# Altium schematic sheet 12_PLCLK_100M.SchDoc
size A4
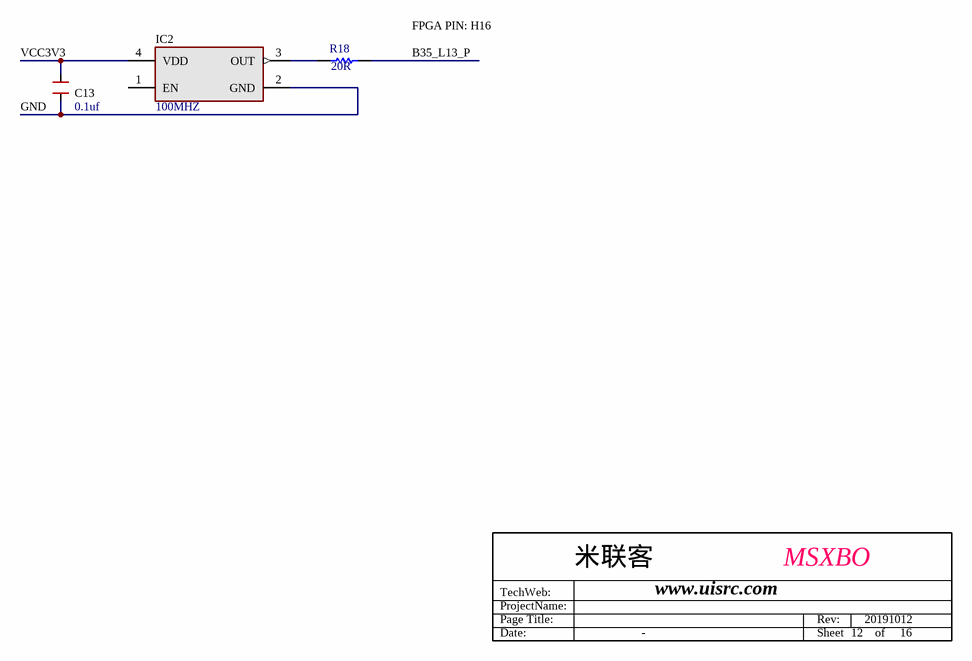
[diagram p0: 12_PLCLK_100M.SchDoc]

## Parts
C13  0.1uf  [CAP0603]
IC2  100MHZ  [3225]
R18  20R  [R0603]

## Nets
B35_L13_P: R18.1
GND: C13.2 IC2.2(GND)
VCC3V3: C13.1 IC2.4(VDD)
NetIC2_3: IC2.3(OUT) R18.2

Not connected (* = marked no-connect by the designer): IC2 1(EN)

## Notes on the sheet
- FPGA PIN: H16
- ProjectName:
- TechWeb:
- Page Title:
- 米联客
- www.uisrc.com
- MSXBO
- Rev:
- 20191012
- Date:
- -
- Sheet
- 12    of     16

## Library data of the parts
C13 = CAPACITOR: Generic Capacitor; Value: 10nF; DPN: *; Manufacturer: *
IC2 = FXO-HC5: 3.3V HCMOS Oscillator; Manufacturer: Fox Electronics; Value: 26MHz; DPN: *
R18 = Res: 1K